# Altium schematic sheet ui.SchDoc
size A4; SheetNumber: 7; SheetTotal: 7
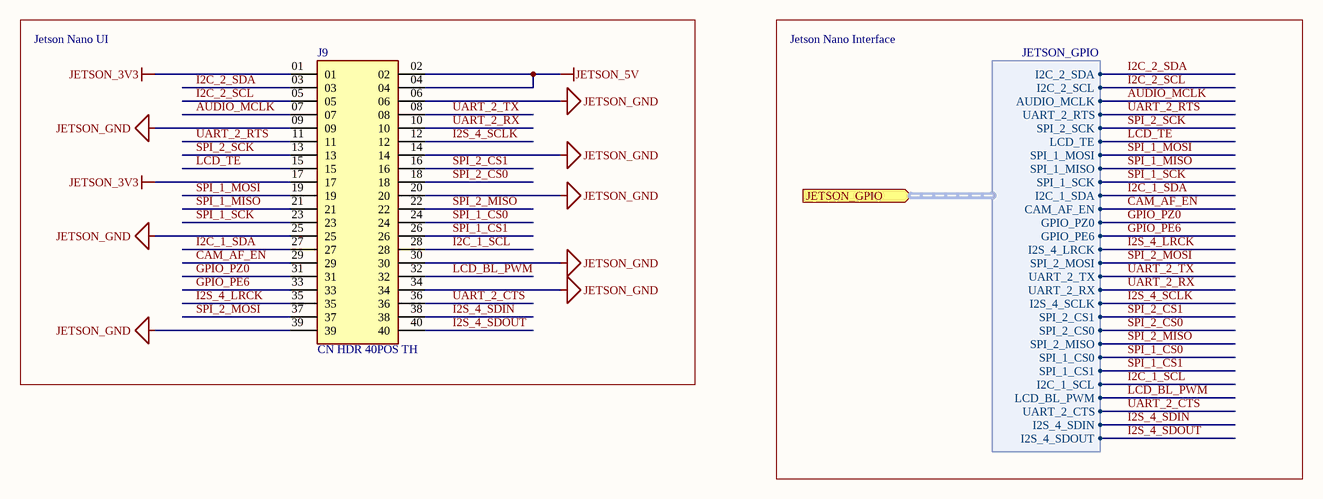
[diagram p0: ui.SchDoc]

## Parts
J9  CN HDR 40POS TH  [SAMTEC_SSQ-120-22-G-D]

## Blocks framed on the sheet
Jetson Nano UI: J9

## Ports
JETSON_GPIO (in, harness JETSON_GPIO)

## Harnesses
JETSON_GPIO: I2C_2_SDA, I2C_2_SCL, AUDIO_MCLK, UART_2_RTS, SPI_2_SCK, LCD_TE, SPI_1_MOSI, SPI_1_MISO, SPI_1_SCK, I2C_1_SDA, CAM_AF_EN, GPIO_PZ0, GPIO_PE6, I2S_4_LRCK, SPI_2_MOSI, UART_2_TX, UART_2_RX, I2S_4_SCLK, SPI_2_CS1, SPI_2_CS0, SPI_2_MISO, SPI_1_CS0, SPI_1_CS1, I2C_1_SCL, LCD_BL_PWM, UART_2_CTS, I2S_4_SDIN, I2S_4_SDOUT

## Nets
JETSON_3V3: J9.01 J9.17
JETSON_5V: J9.02 J9.04
JETSON_GND: J9.06 J9.09 J9.14 J9.20 J9.25 J9.30 J9.34 J9.39
AUDIO_MCLK: J9.07 ; port JETSON_GPIO.AUDIO_MCLK
CAM_AF_EN: J9.29 ; port JETSON_GPIO.CAM_AF_EN
GPIO_PE6: J9.33 ; port JETSON_GPIO.GPIO_PE6
GPIO_PZ0: J9.31 ; port JETSON_GPIO.GPIO_PZ0
I2C_1_SCL: J9.28 ; port JETSON_GPIO.I2C_1_SCL
I2C_1_SDA: J9.27 ; port JETSON_GPIO.I2C_1_SDA
I2C_2_SCL: J9.05 ; port JETSON_GPIO.I2C_2_SCL
I2C_2_SDA: J9.03 ; port JETSON_GPIO.I2C_2_SDA
I2S_4_LRCK: J9.35 ; port JETSON_GPIO.I2S_4_LRCK
I2S_4_SCLK: J9.12 ; port JETSON_GPIO.I2S_4_SCLK
I2S_4_SDIN: J9.38 ; port JETSON_GPIO.I2S_4_SDIN
I2S_4_SDOUT: J9.40 ; port JETSON_GPIO.I2S_4_SDOUT
LCD_BL_PWM: J9.32 ; port JETSON_GPIO.LCD_BL_PWM
LCD_TE: J9.15 ; port JETSON_GPIO.LCD_TE
SPI_1_CS0: J9.24 ; port JETSON_GPIO.SPI_1_CS0
SPI_1_CS1: J9.26 ; port JETSON_GPIO.SPI_1_CS1
SPI_1_MISO: J9.21 ; port JETSON_GPIO.SPI_1_MISO
SPI_1_MOSI: J9.19 ; port JETSON_GPIO.SPI_1_MOSI
SPI_1_SCK: J9.23 ; port JETSON_GPIO.SPI_1_SCK
SPI_2_CS0: J9.18 ; port JETSON_GPIO.SPI_2_CS0
SPI_2_CS1: J9.16 ; port JETSON_GPIO.SPI_2_CS1
SPI_2_MISO: J9.22 ; port JETSON_GPIO.SPI_2_MISO
SPI_2_MOSI: J9.37 ; port JETSON_GPIO.SPI_2_MOSI
SPI_2_SCK: J9.13 ; port JETSON_GPIO.SPI_2_SCK
UART_2_CTS: J9.36 ; port JETSON_GPIO.UART_2_CTS
UART_2_RTS: J9.11 ; port JETSON_GPIO.UART_2_RTS
UART_2_RX: J9.10 ; port JETSON_GPIO.UART_2_RX
UART_2_TX: J9.08 ; port JETSON_GPIO.UART_2_TX

## Notes on the sheet
- Jetson Nano Interface

## Library data of the parts
J9 = CN HDR 40POS TH: SSQ - Samtec 2.54mm Square Tail Dual Row Socket Strip 8.5mm Profile; MP: SSQ-120-22-G-D; Value: *; Price: None; Package: None; MF: Samtec; Check_prices: https://www.snapeda.com/parts/SSQ-120-22-G-D/Samtec/view-part/3393219/?ref=eda; Availability: In Stock; SnapEDA_Link: https://www.snapeda.com/parts/SSQ-120-22-G-D/Samtec/view-part/3393219/?ref=snap; Purchase-URL: https://pricing.snapeda.com/search/part/SSQ-120-22-G-D/?ref=eda; Digikey: S6104-ND